# Altium schematic sheet Sheet1.SchDoc
size A4; SheetNumber: 1; SheetTotal: 1
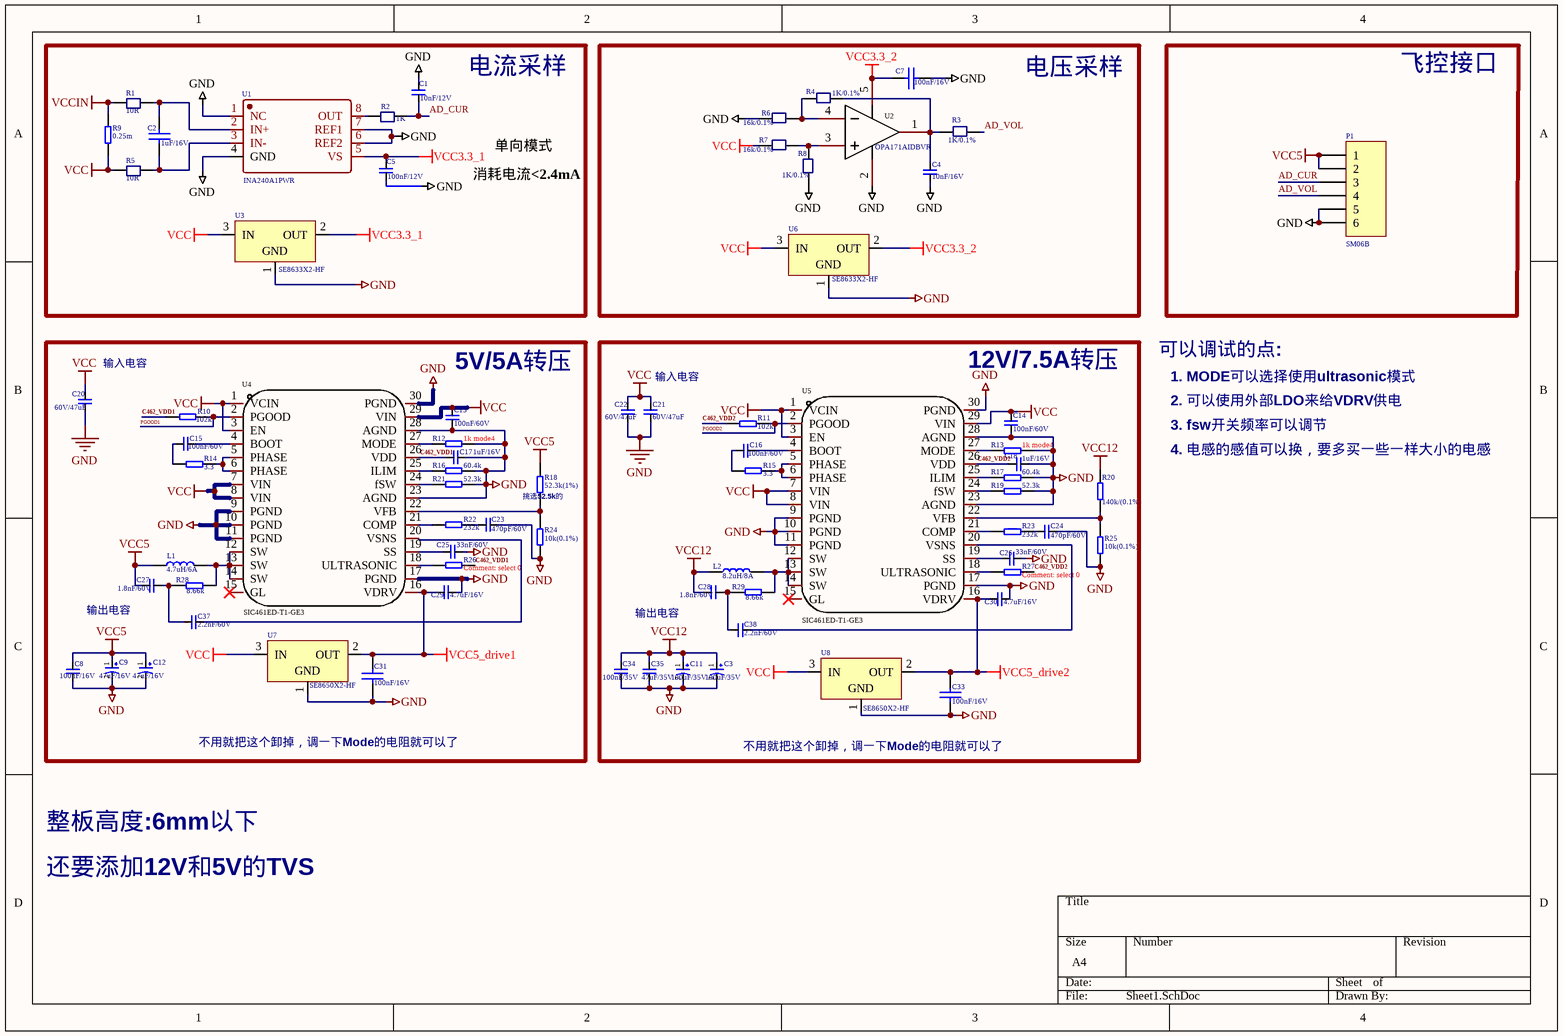
[diagram p0: Sheet1.SchDoc]

## Parts
C1  10nF/12V  [C0402]
C2  1uF/16V  [C 0603_M]
C3  100uF/35V  [CASE-B-3528]
C4  10nF/16V  [C0402]
C5  100nF/12V  [C0402]
C7  100nF/16V  [C0402]
C8  100nF/16V  [C0402]
C9  47uF/16V  [CASE-B-3528]
C11  100uF/35V  [CASE-B-3528]
C12  47uF/16V  [CASE-B-3528]
C13  100nF/60V  [C0402]
C14  100nF/60V  [C0402]
C15  100nF/60V  [C0402]
C16  100nF/60V  [C0402]
C17  1uF/16V  [C0402]
C18  1uF/16V  [C0402]
C20  60V/47uF  [C 1210]
C21  60V/47uF  [C 1210]
C22  60V/47uF  [C 1210]
C23  470pF/60V  [C0402]
C24  470pF/60V  [C 0603_M]
C25  33nF/60V  [C0402]
C26  33nF/60V  [C0402]
C27  1.8nF/60V  [C0402]
C28  1.8nF/60V  [C0402]
C29  4.7uF/16V  [C 0603_M]
C30  4.7uF/16V  [C 0603_M]
C31  100nF/16V  [C0402]
C33  100nF/16V  [C0402]
C34  100nF/35V  [C0402]
C35  47uF/35V  [CAP-SMD_L3.2-W1.6]
C37  2.2nF/60V  [C0402]
C38  2.2nF/60V  [C0402]
L1  4.7uH/6A  [IND-SMD_L7.1-W6.6]
L2  8.2uH/8A  [IND-SMD_L11.5-W10.0_SMMS1040]
P1  SM06B  [BM06B-GHS-TBT]
R1  10R  [R0402]
R2  1K  [R0402]
R3  1K/0.1%  [R0402]
R4  1K/0.1%  [R0402]
R5  10R  [R0402]
R6  16k/0.1%  [R0402]
R7  16k/0.1%  [R0402]
R8  1K/0.1%  [R0402]
R9  0.25m  [R1216]
R10  102k  [R0402]
R11  102k  [R0402]
R12  1k mode4  [R0603_M]
R13  1k mode4  [R0402]
R14  3.3  [R0402]
R15  3.3  [R0402]
R16  60.4k  [R0402]
R17  60.4k  [R0402]
R18  52.3k(1%)  [R0402]
R19  52.3k  [R0402]
R20  140k/(0.1%)  [R0402]
R21  52.3k  [R0402]
R22  232k  [R0402]
R23  232k  [R0603_M]
R24  10k(0.1%)  [R0402]
R25  10k(0.1%)  [R0402]
R26  select 0  [R0402]
R27  select 0  [R0402]
R28  8.66k  [R0402]
R29  8.66k  [R0402]
U1  INA240A1PWR  [TSSOP-8_L4.4-W3.0-P0.65-LS6.4-BL]
U2  OPA171AIDBVR  [SOT-23-5_L3.0-W1.7-P0.95-LS2.8-BR]
U3  SE8633X2-HF  [SOT_23]
U4  SIC461ED-T1-GE3  [MLP55-27_L5.0-W5.0-P0.50-TL_SIC46XXX]
U5  SIC461ED-T1-GE3  [MLP55-27_L5.0-W5.0-P0.50-TL_SIC46XXX]
U6  SE8633X2-HF  [SOT_23]
U7  SE8650X2-HF  [SOT_23]
U8  SE8650X2-HF  [SOT_23]

## Blocks framed on the sheet
电流采样: C1 C2 C5 R1 R2 R5 R9 U1 U3
电压采样: C4 C7 R3 R4 R6-R8 U2 U6
飞控接口: P1
5V/5A转压: C8 C9 C12 C13 C15 C17 C20 C23 C25 C27 C29 C31 C37 L1 R10 R12 R14 R16 R18 R21 R22 R24 R26 R28 U4 U7
12V/7.5A转压: C3 C11 C14 C16 C18 C21 C22 C24 C26 C28 C30 C33-C35 C38 L2 R11 R13 R15 R17 R19 R20 R23 R25 R27 R29 U5 U8

## Nets
GND: C1.2 C3.2 C4.2 C5.1 C7.2 C8.2 C9.2 C11.2 C12.2 C13.1 C14.1 C17.1 C18.1 C20.2 C21.2 C22.2 C23.1 C24.1 C25.1 C26.1 C29.1 C30.1 C31.1 C33.1 C34.2 C35.2 P1.5 P1.6 R6.2 R8.2 R12.2 R13.2 R16.2 R17.2 R19.2 R21.2 R24.2 R25.2 U1.1(NC) U1.4(GND) U1.6(REF2) U1.7(REF1) U2.2(V-) U3.1(GND) U4.9(PGND) U4.10(PGND) U4.11(PGND) U4.17(PGND) U4.23(AGND) U4.28(AGND) U4.30(PGND) U5.9(PGND) U5.10(PGND) U5.11(PGND) U5.17(PGND) U5.23(AGND) U5.28(AGND) U5.30(PGND) U6.1(GND) U7.1(GND) U8.1(GND)
VCC: C13.2 C14.2 C20.1 C21.1 C22.1 R5.1 R7.2 R9.2 U3.3(IN) U4.1(VCIN) U4.3(EN) U4.7(VIN) U4.8(VIN) U4.29(VIN) U5.1(VCIN) U5.3(EN) U5.7(VIN) U5.8(VIN) U5.29(VIN) U6.3(IN) U7.3(IN) U8.3(IN)
VCC3.3_1: C5.2 U1.5(VS) U3.2(OUT)
VCC3.3_2: C7.1 U2.5(V+) U6.2(OUT)
VCC5: C8.1 C9.1 C12.1 C27.2 L1.1 P1.1 P1.2 R18.2
VCC5_drive1: C29.2 C31.2 U4.16(VDRV) U7.2(OUT)
VCC5_drive2: C30.2 C33.2 U5.16(VDRV) U8.2(OUT)
VCC12: C3.1 C11.1 C28.2 C34.1 C35.1 L2.1 R20.2
VCCIN: R1.1 R9.1
AD_CUR: C1.1 P1.3 R2.2
AD_VOL: P1.4 R3.1
C462_VDD1: C17.2 R10.1 R26.2 U4.26(VDD)
C462_VDD2: C18.2 R11.1 R27.2 U5.26(VDD)
PGOOD1: R10.2 U4.2(PGOOD)
PGOOD2: R11.2 U5.2(PGOOD)
NetC2_1: C2.1 R5.2 U1.3(IN-)
NetC2_2: C2.2 R1.2 U1.2(IN+)
NetC4_1: C4.1 R3.2 R4.1 U2.1(OUT)
NetC15_1: C15.1 U4.4(BOOT)
NetC15_2: C15.2 R14.1
NetC16_1: C16.1 U5.4(BOOT)
NetC16_2: C16.2 R15.1
NetC23_2: C23.2 R22.2
NetC24_2: C24.2 R23.2
NetC25_2: C25.2 U4.19(SS)
NetC26_2: C26.2 U5.19(SS)
NetC27_1: C27.1 C37.2 R28.1
NetC28_1: C28.1 C38.2 R29.1
NetC37_1: C37.1 U4.20(VSNS)
NetC38_1: C38.1 U5.20(VSNS)
NetL1_2: L1.2 R28.2 U4.12(SW) U4.13(SW) U4.14(SW)
NetL2_2: L2.2 R29.2 U5.12(SW) U5.13(SW) U5.14(SW)
NetR2_1: R2.1 U1.8(OUT)
NetR4_2: R4.2 R6.1 U2.4(IN-)
NetR7_1: R7.1 R8.1 U2.3(IN+)
NetR12_1: R12.1 U4.27(MODE)
NetR13_1: R13.1 U5.27(MODE)
NetR14_2: R14.2 U4.5(PHASE) U4.6(PHASE)
NetR15_2: R15.2 U5.5(PHASE) U5.6(PHASE)
NetR16_1: R16.1 U4.25(ILIM)
NetR17_1: R17.1 U5.25(ILIM)
NetR18_1: R18.1 R24.1 U4.22(VFB)
NetR19_1: R19.1 U5.24(fSW)
NetR20_1: R20.1 R25.1 U5.22(VFB)
NetR21_1: R21.1 U4.24(fSW)
NetR22_1: R22.1 U4.21(COMP)
NetR23_1: R23.1 U5.21(COMP)
NetR26_1: R26.1 U4.18(ULTRASONIC)
NetR27_1: R27.1 U5.18(ULTRASONIC)

Not connected (* = marked no-connect by the designer): U4 15(GL)*; U5 15(GL)*

## Notes on the sheet
- 消耗电流<2.4mA
- 单向模式
- (near C20) 输入电容
- 输入电容
- 可以调试的点:
- 1. MODE可以选择使用ultrasonic模式
- 2. 可以使用外部LDO来给VDRV供电
- 3. fsw开关频率可以调节
- (near R18) 挑选52.5k的
- 4. 电感的感值可以换，要多买一些一样大小的电感
- 输出电容
- 不用就把这个卸掉，调一下Mode的电阻就可以了
- (near U8) 不用就把这个卸掉，调一下Mode的电阻就可以了
- 整板高度:6mm以下
- 还要添加12V和5V的TVS

## Library data of the parts
C1 C4 C5 C8 C13-C18 C20-C26 C29 C30 C34 C35 = C
C2 C7 C31 C33 = Cap: Capacitor; Published: 8-Jun-2000; LatestRevisionDate: 17-Jul-2002; LatestRevisionNote: Re-released for DXP Platform.; PackageReference: RAD-0.3; Publisher: Altium Limited; PackageDescription: Radial Cap, Thru-Hole; 2 Leads; 0.3 in Pin Spacing
C3 C11 = CP: 极性电容 / 多为大容量铝电解 / NPXD0601V101MF / 100uF/35V / C2976304
C9 C12 = CP: 极性电容 / 多为大容量铝电解
C27 C28 C37 C38 = C: C1853237
L1 = L: FXL0650-4R7-M / 4.7uH ±20% 6A 6.6mm*7mm*4.8mm / C475520
L2 = L: FXL1040-8R2-M / SMD,11.5*10.0mm*3.8mm / C167202
P1 = P SM06B: Header, 6-Pin; LatestRevisionDate: 17-Jul-2002; LatestRevisionNote: Re-released for DXP Platform.; Publisher: Altium Limited
R1-R8 = Res: Resistor; Published: 8-Jun-2000; LatestRevisionDate: 17-Jul-2002; LatestRevisionNote: Re-released for DXP Platform.; PackageReference: AXIAL-0.4; Publisher: Altium Limited
R9-R25 R28 R29 = R: 贴片电阻HoBB1216-5W-0.25-1% / C17701555; BOM名称: 贴片电阻; 版权归属: 黎明电子style; 学习资源: https://lmdzstyle.taobao.com/
R26 R27 = R: BOM名称: 贴片电阻; 版权归属: 黎明电子style; 学习资源: https://lmdzstyle.taobao.com/
U1 = INA240A1PWR: BOM_Manufacturer: TI; Contributor: LCSC; SMT Type: Extend; BOM_Supplier: LCSC; BOM_Manufacturer Part: INA240A1PWR; BOM_Supplier Part: C93965; BOM_LCSC Assembly: Yes; spicePre: U; spiceSymbolName: INA240A1PWR
U2 = OPA171AIDBVR: Manufacturer: TI(德州仪器); Add into BOM: yes; Amplifier Type: General Purpose; Number of Circuits: 1; Gain Bandwidth Product（GBP）: 3MHz; Slew Rate（SR）: 1.5 V/us; Output Type: Rail-to-Rail; Supply Voltage（Single）: 2.7V ~ 36V, ±1.35V ~ 18V; Iq per channel (Typ): 475uA; Name: OPA171AIDBVR; Symbol: OPA171AIDBVR; Device: OPA171AIDBVR; LCSC Part Name: OPA171AIDBVR; Supplier Part: C88036; Manufacturer Part: OPA171AIDBVR; Supplier Footprint: SOT-23-5; JLCPCB Part Class: Extended Part; Datasheet: https://atta.szlcsc.com/upload/public/pdf/source/20170919/C88036_1505787414165977297.pdf; Supplier: LCSC; Convert to PCB: yes; Operating Temperature: -40°C ~ 125°C
U3 U6 U8 = LM1117-3.3: 200mA Low-Dropout Linear Regulator, 3-pin SOT-23; PartNumber: LM1117T-3.3; Manufacturer: National Semiconductor; PackageTopMarking: NSUZXYTTE#*LM1117T*3.3; PowerWise: N; CompType: LDO IC; Published: 4-Dec-2008; DatasheetVersion: Apr-2006; PackageVersion: revL, Jan-1992; PackageReference: T03B; Publisher: Altium Limited; PackageDescription: TO-220, Molded, 3 Lead, Straight; Supplier 1: Farnell; Supplier Part Number 1: 9485813; RoHS: N; PinCount: 3; ComponentLink1Description: LM1117 Datasheet; ComponentLink1URL: http://www.national.com/ds/LM/LM1117.pdf; ComponentLink2Description: LM1117 Web Page; ComponentLink2URL: http://www.national.com/pf/LM/LM1117.html; ComponentLink3Description: T03B Package Page; ComponentLink3URL: http://www.national.com/packaging/folders/t03b.html
U4 U5 = U SIC461ED-T1-GE3: 5V output; Manufacturer: VISHAY(威世); Add into BOM: yes; Function: 降压型; Synchronous Rectification: 是; Output Type: 可调; Number of Outputs: 1; Topology: 降压式; Input Voltage: 4.5V~60V; Output Voltage: 800mV~55.2V; Output Current (Max): 10A; Switching Frequency: 2MHz; Name: SIC461ED-T1-GE3; Symbol: SIC461ED-T1-GE3; Device: SIC461ED-T1-GE3; LCSC Part Name: 降压型 Vin=4.5V~60V Vout=800mV~55.2V 10A; Supplier Part: C499531; Manufacturer Part: SIC461ED-T1-GE3; Supplier Footprint: MLP55-27L(5x5); JLCPCB Part Class: Extended Part; Datasheet: https://atta.szlcsc.com/upload/public/pdf/source/20200324/C499531_C16045847F4DF0303B2652BC26370E16.pdf; Supplier: LCSC; Convert to PCB: yes; Operating Temperature: -40℃~+125℃@(TJ)
U7 = LM1117-3.3: 200mA Low-Dropout Linear Regulator, 3-pin SOT-23 / C496615; PartNumber: LM1117T-3.3; Manufacturer: National Semiconductor; PackageTopMarking: NSUZXYTTE#*LM1117T*3.3; PowerWise: N; CompType: LDO IC; Published: 4-Dec-2008; DatasheetVersion: Apr-2006; PackageVersion: revL, Jan-1992; PackageReference: T03B; Publisher: Altium Limited; PackageDescription: TO-220, Molded, 3 Lead, Straight; Supplier 1: Farnell; Supplier Part Number 1: 9485813; RoHS: N; PinCount: 3; ComponentLink1Description: LM1117 Datasheet; ComponentLink1URL: http://www.national.com/ds/LM/LM1117.pdf; ComponentLink2Description: LM1117 Web Page; ComponentLink2URL: http://www.national.com/pf/LM/LM1117.html; ComponentLink3Description: T03B Package Page; ComponentLink3URL: http://www.national.com/packaging/folders/t03b.html